# EAGLE design e-Tapperhandpiece20 (EAGLE 8.4.0)
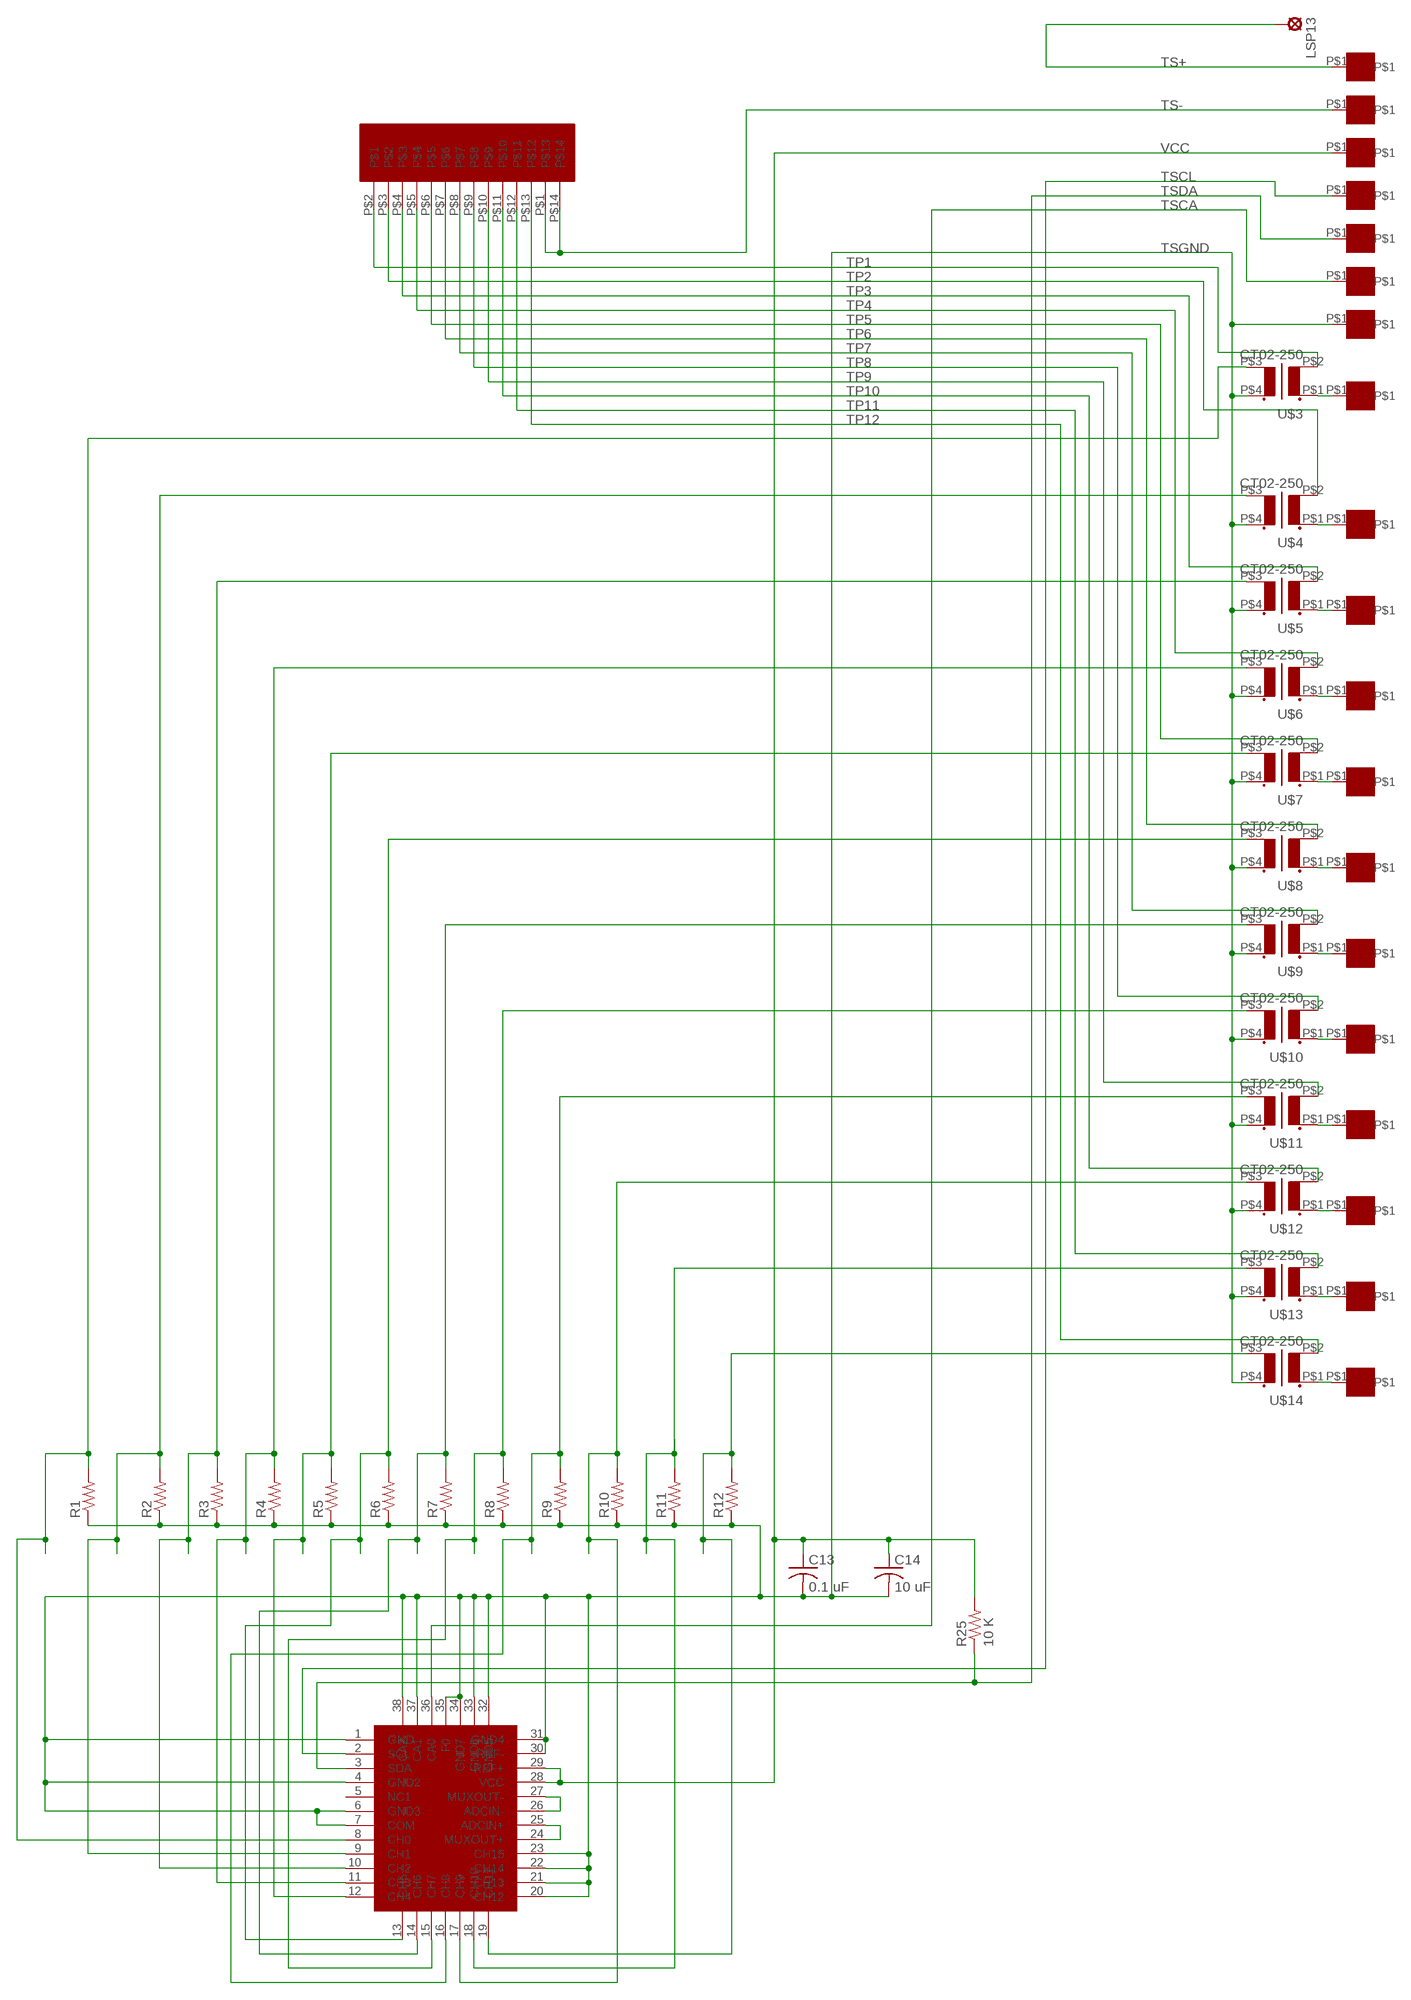
[diagram p0: schematic, sheet 1]

## Parts
C13  0.1 uF  C-USC0603  [C0603]
C14  10 uF  C-USC0805  [C0805]
LSP13  SE11  [SE11]
R1  R-US_R0402  [R0402]
R2  R-US_R0402  [R0402]
R3  R-US_R0402  [R0402]
R4  R-US_R0402  [R0402]
R5  R-US_R0402  [R0402]
R6  R-US_R0402  [R0402]
R7  R-US_R0402  [R0402]
R8  R-US_R0402  [R0402]
R9  R-US_R0402  [R0402]
R10  R-US_R0402  [R0402]
R11  R-US_R0402  [R0402]
R12  R-US_R0402  [R0402]
R25  10 K  R-US_R0402  [R0402]
TSP1  ET1  [ET1]
TSP2  ET1  [ET1]
TSP3  ET1  [ET1]
TSP4  ET1  [ET1]
TSP5  ET1  [ET1]
TSP6  ET1  [ET1]
TSP7  ET1  [ET1]
TSP8  ET1  [ET1]
TSP9  ET1  [ET1]
TSP10  ET1  [ET1]
TSP11  ET1  [ET1]
TSP12  ET1  [ET1]
TSP13  ET1  [ET1]
TSP14  ET1  [ET1]
TSP15  ET1  [ET1]
TSP16  ET1  [ET1]
TSP17  ET1  [ET1]
TSP18  ET1  [ET1]
TSP19  ET1  [ET1]
U$1  LTC2497  [QFN38-5X7]
U$2  SS112D01  [SS112D01]
U$3  CT02-250  [CT02-250]
U$4  CT02-250  [CT02-250]
U$5  CT02-250  [CT02-250]
U$6  CT02-250  [CT02-250]
U$7  CT02-250  [CT02-250]
U$8  CT02-250  [CT02-250]
U$9  CT02-250  [CT02-250]
U$10  CT02-250  [CT02-250]
U$11  CT02-250  [CT02-250]
U$12  CT02-250  [CT02-250]
U$13  CT02-250  [CT02-250]
U$14  CT02-250  [CT02-250]

## Nets
N$1: R9.2 U$1.16(CH8) U$11.P$3(S2)
N$2: U$1.26(ADCIN-) U$1.27(MUXOUT-)
N$3: U$1.24(MUXOUT+) U$1.25(ADCIN+)
N$4: TSP1.P$1 U$3.P$1(P1)
N$5: R12.2 U$1.19(CH11) U$14.P$3(S2)
N$6: TSP2.P$1 U$4.P$1(P1)
N$7: R4.2 U$1.11(CH3) U$6.P$3(S2)
N$8: R10.2 U$1.17(CH9) U$12.P$3(S2)
N$9: R8.2 U$1.15(CH7) U$10.P$3(S2)
N$10: TSP3.P$1 U$5.P$1(P1)
N$11: TSP4.P$1 U$6.P$1(P1)
N$12: TSP5.P$1 U$7.P$1(P1)
N$13: TSP6.P$1 U$8.P$1(P1)
N$14: TSP7.P$1 U$9.P$1(P1)
N$15: TSP8.P$1 U$10.P$1(P1)
N$16: TSP9.P$1 U$11.P$1(P1)
N$17: TSP10.P$1 U$12.P$1(P1)
N$18: R5.2 U$1.12(CH4) U$7.P$3(S2)
N$19: R6.2 U$1.13(CH5) U$8.P$3(S2)
N$20: R7.2 U$1.14(CH6) U$9.P$3(S2)
N$21: TSP11.P$1 U$13.P$1(P1)
N$22: R3.2 U$1.10(CH2) U$5.P$3(S2)
N$23: R2.2 U$1.9(CH1) U$4.P$3(S2)
N$24: R11.2 U$1.18(CH10) U$13.P$3(S2)
N$25: R1.2 U$1.8(CH0) U$3.P$3(S2)
N$26: TSP12.P$1 U$14.P$1(P1)
TP1: U$2.P$2 U$3.P$2(P2)
TP2: U$2.P$3 U$4.P$2(P2)
TP3: U$2.P$4 U$5.P$2(P2)
TP4: U$2.P$5 U$6.P$2(P2)
TP5: U$2.P$6 U$7.P$2(P2)
TP6: U$2.P$7 U$8.P$2(P2)
TP7: U$2.P$8 U$9.P$2(P2)
TP8: U$2.P$9 U$10.P$2(P2)
TP9: U$2.P$10 U$11.P$2(P2)
TP10: U$2.P$11 U$12.P$2(P2)
TP11: U$2.P$12 U$13.P$2(P2)
TP12: U$2.P$13 U$14.P$2(P2)
TS+: LSP13.MP TSP13.P$1
TS-: TSP14.P$1 U$2.P$1 U$2.P$14
TSCA: TSP18.P$1 U$1.36(CA0)
TSCL: TSP16.P$1 U$1.2(SCL)
TSDA: R25.1 TSP17.P$1 U$1.3(SDA)
TSGND: C13.2 C14.2 R1.1 R2.1 R3.1 R4.1 R5.1 R6.1 R7.1 R8.1 R9.1 R10.1 R11.1 R12.1 TSP19.P$1 U$1.1(GND) U$1.4(GND2) U$1.6(GND3) U$1.7(COM) U$1.20(CH12) U$1.21(CH13) U$1.22(CH14) U$1.23(CH15) U$1.30(REF-) U$1.31(GND4) U$1.32(GND5) U$1.33(GND6) U$1.34(GND7) U$1.35(F0) U$1.37(CA1) U$1.38(CA2) U$3.P$4(S1) U$4.P$4(S1) U$5.P$4(S1) U$6.P$4(S1) U$7.P$4(S1) U$8.P$4(S1) U$9.P$4(S1) U$10.P$4(S1) U$11.P$4(S1) U$12.P$4(S1) U$13.P$4(S1) U$14.P$4(S1)
VCC: C13.1 C14.1 R25.2 TSP15.P$1 U$1.28(VCC) U$1.29(REF+)
Unconnected: U$1.5(NC1)

## Library data of the parts
C13 C14 = rcl:C-US: CAPACITOR, American symbol
LSP13 = solpad:SE11: SOLDER PAD RTM, drill 1,1mm, distributor Buerklin, 07F810
R1-R12 R25 = resistor:R-US_: RESISTOR, American symbol
TSP1-TSP19 = ET1:ET1: Through Hold Pads 20 mil drill hole
U$1 = LTC2497:LTC2497: LTC2497 16 Channel ADC with I2C interface
U$2 = SS112D01:SS112D01
U$3-U$14 = CT02-250:CT02-250: Current Transformer ICE Components 1:250 turns ratio

## Net classes
0 default: clearance 0.205 mm

## Board
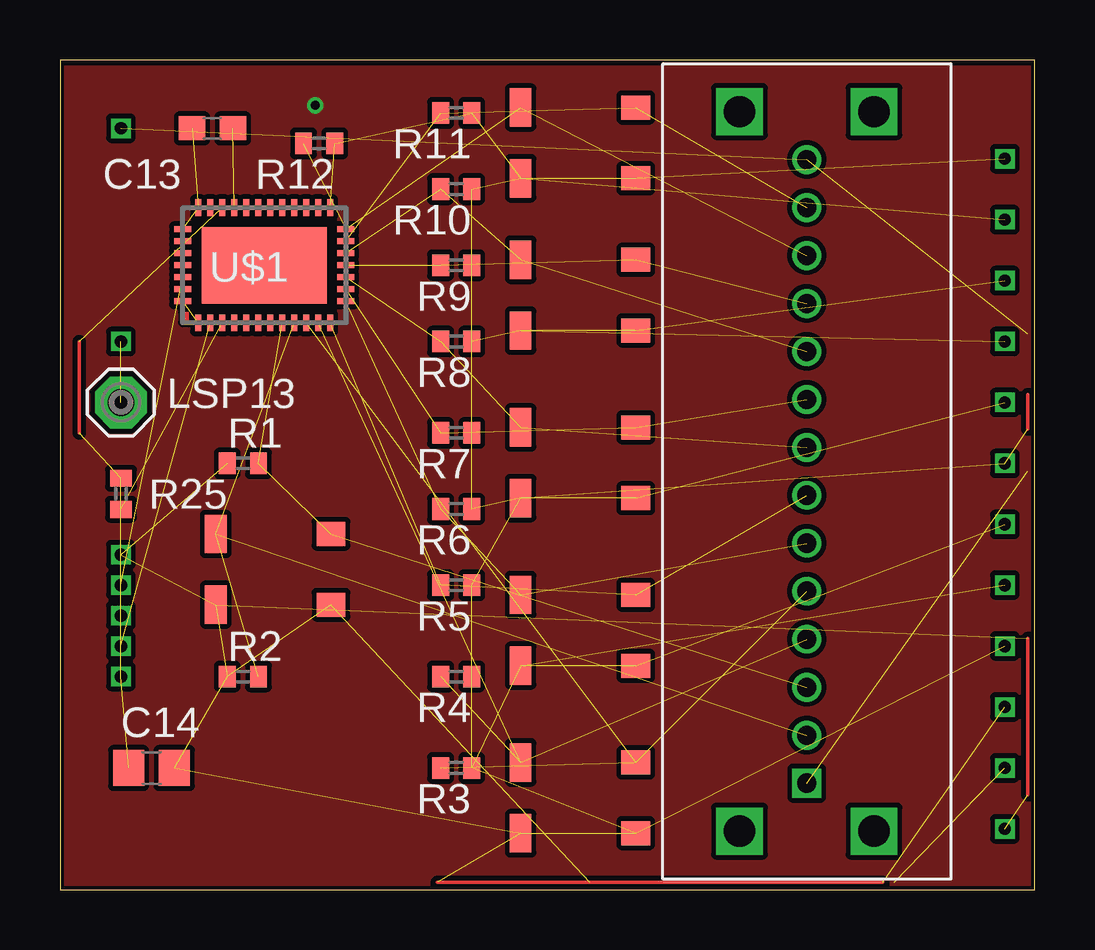
[diagram p1: board, top side]
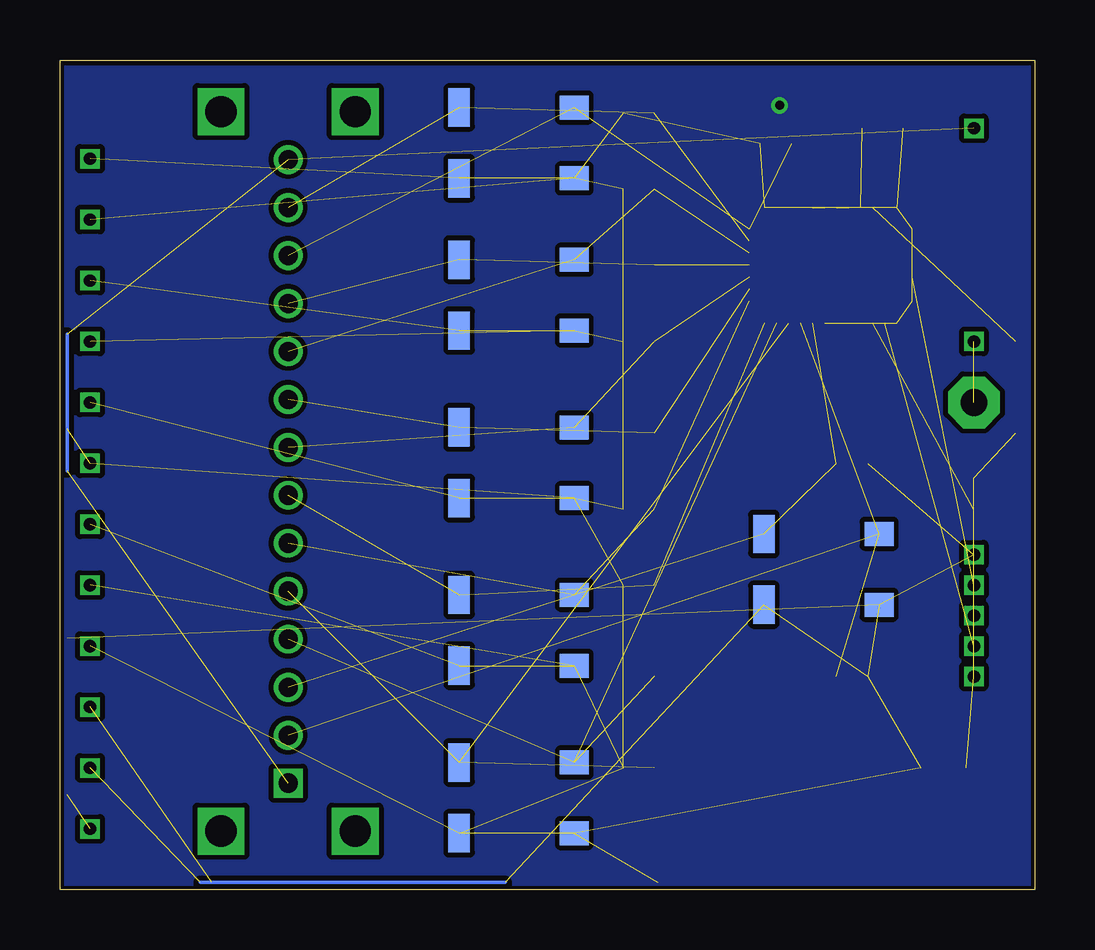
[diagram p2: board, bottom side, seen from below]

Size 40.62 x 34.59 mm. Coordinates in mm from the lower left corner, seen from the top.
Outline: 0,0 40.62,0 40.62,34.59 0,34.59 0,0
Copper layers (1*16): Top 0.035mm / dielectric 1.5mm / Bottom 0.035mm
Design rules "e-tapperhandpiece14 *": minimum track width 6mil, minimum drill 15mil, track to track 6mil, track to pad 6mil, pad to pad 6mil, via to via 6mil, smd to smd 6mil, copper to edge 6mil, drill to drill 6mil, minimum pad ring 6mil, minimum via ring 6mil, stop-mask expansion 4mil, vias tented up to drill 0mil, thermal gap 10mil

### Footprints (pad centres in the part's own frame; a part is rotated, then mirrored left to right if it is on the bottom)
C0603 = smd 1.1 x 1: 1 -0.85,0; 2 0.85,0
C0805 = smd 1.3 x 1.5: 1 -0.95,0; 2 0.95,0
SE11 = drill 1.118 pad 2.159 octagon: MP 0,0
R0402 = smd 0.7 x 0.9: 1 -0.65,0; 2 0.65,0
ET1 = drill 0.508 square: P$1 0,0
QFN38-5X7 = smd 0.7 x 0.25: 1 -2.4,2.75; 2 -2.4,2.25; 3 -2.4,1.75; 4 -2.4,1.25; 5 -2.4,0.75; 6 -2.4,0.25; 7 -2.4,-0.25; 8 -2.4,-0.75; 9 -2.4,-1.25; 10 -2.4,-1.75; 11 -2.4,-2.25; 12 -2.4,-2.75; 20 2.4,-2.75; 21 2.4,-2.25; 22 2.4,-1.75; 23 2.4,-1.25; 24 2.4,-0.75; 25 2.4,-0.25; 26 2.4,0.25; 27 2.4,0.75; 28 2.4,1.25; 29 2.4,1.75; 30 2.4,2.25; 31 2.4,2.75 | smd 0.25 x 0.7: 13 -1.5,-3.4; 14 -1,-3.4; 15 -0.5,-3.4; 16 0,-3.4; 17 0.5,-3.4; 18 1,-3.4; 19 1.5,-3.4; 32 1.5,3.4; 33 1,3.4; 34 0.5,3.4; 35 0,3.4; 36 -0.5,3.4; 37 -1,3.4; 38 -1.5,3.4 | smd 3.2 x 5.2: EXP 0,0
SS112D01 = drill 0.8 square: P$1 6.35,3.81 | drill 0.8: P$2 6.35,5.81; P$3 6.35,7.81; P$4 6.35,9.81; P$5 6.35,11.81; P$6 6.35,13.81; P$7 6.35,15.81; P$8 6.35,17.81; P$9 6.35,19.81; P$10 6.35,21.81; P$11 6.35,23.81; P$12 6.35,25.81; P$13 6.35,27.81; P$14 6.35,29.81 | drill 1.3 square: P$15 9.15,31.81; P$16 3.55,31.81; P$17 9.15,1.81; P$18 3.55,1.81
CT02-250 = smd 1 x 1.2: P$1 -1.45,-2.4; P$2 1.5,-2.4 | smd 1.6 x 0.9: P$3 1.5,2.4; P$4 -1.45,2.4

### Placement (x,y rotation side)
C13  6.35,31.75 180 top
C14  3.81,5.08 0 top
LSP13  2.54,20.32 0 top
R1  7.62,17.78 0 top
R2  7.62,8.89 0 top
R3  16.51,5.08 180 top
R4  16.51,8.89 180 top
R5  16.51,12.7 180 top
R6  16.51,15.87 180 top
R7  16.51,19.05 180 top
R8  16.51,22.86 180 top
R9  16.51,26.04 180 top
R10  16.51,29.21 180 top
R11  16.51,32.38 180 top
R12  10.79,31.11 180 top
R25  2.54,16.51 90 top
TSP1  39.37,2.54 0 top
TSP2  39.37,5.08 0 top
TSP3  39.37,7.62 0 top
TSP4  39.37,10.16 0 top
TSP5  39.37,12.7 0 top
TSP6  39.37,15.24 0 top
TSP7  39.37,17.78 0 top
TSP8  39.37,20.32 0 top
TSP9  39.37,22.86 0 top
TSP10  39.37,25.4 0 top
TSP11  39.37,27.94 0 top
TSP12  39.37,30.48 0 top
TSP13  2.54,22.86 0 top
TSP14  2.54,31.75 0 top
TSP15  2.54,8.89 0 top
TSP16  2.54,10.16 0 top
TSP17  2.54,11.43 0 top
TSP18  2.54,12.7 90 top
TSP19  2.54,13.97 90 top
U$1  8.51,26.04 90 top
U$2  24.77,0.64 0 top
U$3  8.89,13.33 90 bottom
U$4  8.89,13.33 90 top
U$5  21.59,3.81 90 bottom
U$6  21.59,3.81 90 top
U$7  21.59,10.79 90 bottom
U$8  21.59,10.79 90 top
U$9  21.59,17.78 90 bottom
U$10  21.59,17.78 90 top
U$11  21.59,24.77 90 bottom
U$12  21.59,24.77 90 top
U$13  21.59,31.11 90 bottom
U$14  21.59,31.11 90 top

### Tracks (layer width: path | path; a pad name or v marks a point on that pad's centre or on a via)
GND  (via drill 0.38)
  other vias: 10.64,32.7
  pour Top: 0,34.29 40.64,34.29 40.64,0 0,0
  pour Bottom: 0,34.29 40.64,34.29 40.64,0 0,0
N$1  (2 unrouted)
N$2  (1 unrouted)
N$3  (1 unrouted)
N$4  (2 unrouted)
  Top 0.152: 40.32,3.97 40.32,10.48
N$5  (2 unrouted)
N$6  (2 unrouted)
  Bottom 0.152: 34.77,0.32 22.07,0.32
N$7  (2 unrouted)
N$8  (2 unrouted)
N$9  (2 unrouted)
N$10  (2 unrouted)
  Top 0.152: 34.29,0.32 15.72,0.32
N$11  (1 unrouted)
N$12  (1 unrouted)
N$13  (1 unrouted)
N$14  (2 unrouted)
  Top 0.152: 40.32,19.21 40.32,20.64
N$15  (1 unrouted)
N$16  (1 unrouted)
N$17  (1 unrouted)
N$18  (2 unrouted)
N$19  (2 unrouted)
N$20  (2 unrouted)
N$21  (1 unrouted)
N$22  (2 unrouted)
N$23  (2 unrouted)
N$24  (2 unrouted)
N$25  (2 unrouted)
N$26  (1 unrouted)
TP1  (1 unrouted)
TP2  (1 unrouted)
TP3  (1 unrouted)
TP4  (1 unrouted)
TP5  (1 unrouted)
TP6  (1 unrouted)
TP7  (1 unrouted)
TP8  (1 unrouted)
TP9  (1 unrouted)
TP10  (1 unrouted)
TP11  (1 unrouted)
TP12  (1 unrouted)
TS+  (1 unrouted)
TS-  (3 unrouted)
  Bottom 0.152: 40.32,23.18 40.32,17.46
TSCA  (1 unrouted)
TSCL  (1 unrouted)
TSDA  (2 unrouted)
TSGND  (42 unrouted)
VCC  (6 unrouted)
  Top 0.152: 0.79,19.05 0.79,22.86